# EAGLE design untitled (1) (EAGLE 9.6.2)
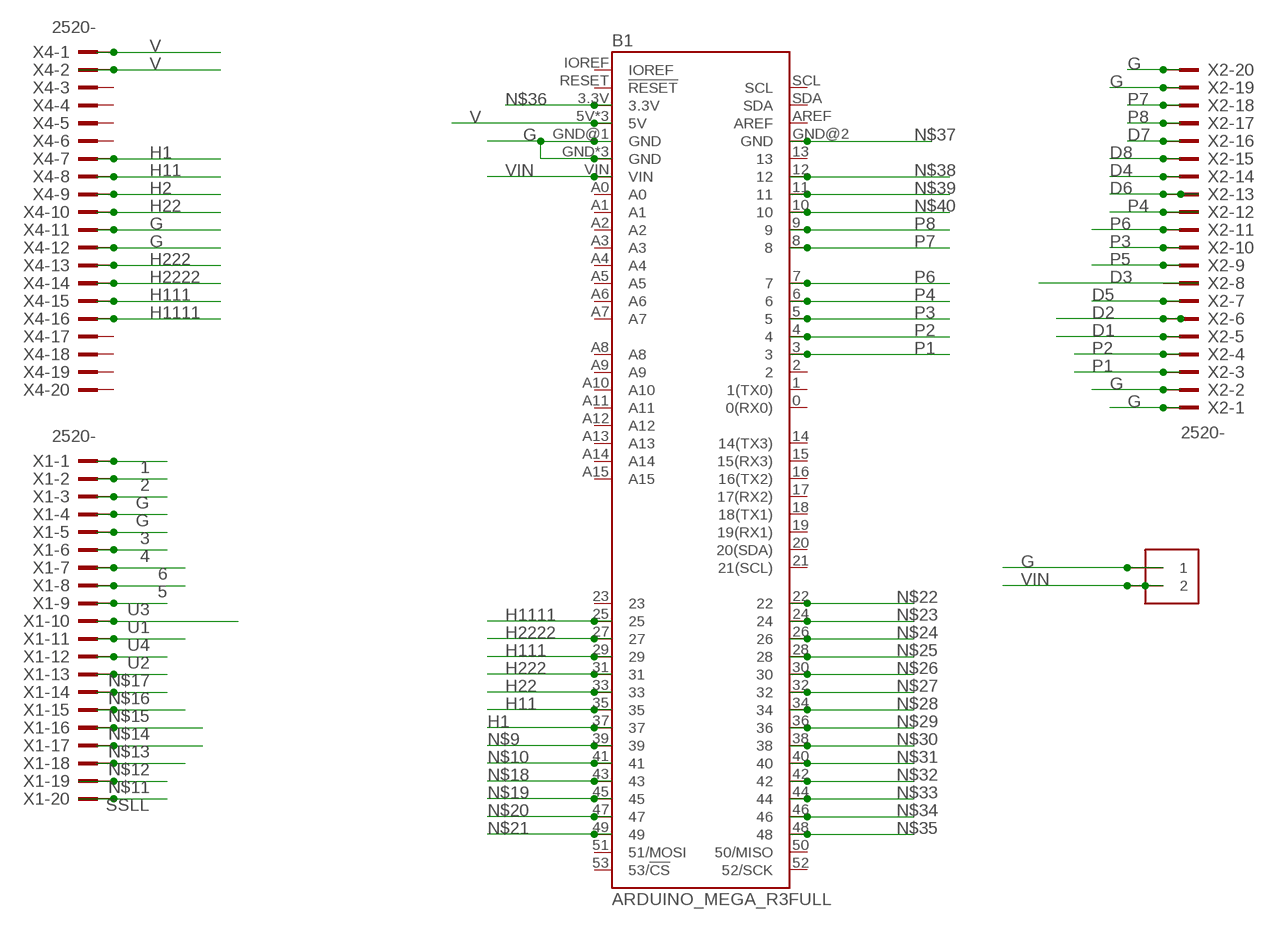
[diagram p0: schematic, sheet 1]

## Parts
B1  ARDUINO_MEGA_R3FULL  [ARDUINO_MEGA_NO_SILK]
J1  1X2-3.5MM  [1X2-3.5MM]
X1  2520-  [PAK100/2500-20]
X2  2520-  [PAK100/2500-20]
X4  2520-  [PAK100/2500-20]

## Nets
1: X1.1
2: X1.2
3: X1.5
4: X1.6
5: X1.8
6: X1.7
D1: X2.5
D2: X2.6
D3: X2.8
D4: X2.14
D5: X2.7
D6: X2.13
D7: X2.16
D8: X2.15
G: B1.GND B1.GND@1(GND) B1.GND@3(GND) B1.GND@4(GND) J1.1 X1.3 X1.4 X2.1 X2.2 X2.19 X2.20 X4.11 X4.12
H1: B1.37 X4.7
H2: X4.9
H11: B1.35 X4.8
H22: B1.33 X4.10
H111: B1.29 X4.15
H222: B1.31 X4.13
H1111: B1.25 X4.16
H2222: B1.27 X4.14
N$9: B1.39
N$10: B1.41
N$11: X1.19
N$12: X1.18
N$13: X1.17
N$14: X1.16
N$15: X1.15
N$16: X1.14
N$17: X1.13
N$18: B1.43
N$19: B1.45
N$20: B1.47
N$21: B1.49
N$22: B1.22
N$23: B1.24
N$24: B1.26
N$25: B1.28
N$26: B1.30
N$27: B1.32
N$28: B1.34
N$29: B1.36
N$30: B1.38
N$31: B1.40
N$32: B1.42
N$33: B1.44
N$34: B1.46
N$35: B1.48
N$36: B1.3.3V
N$37: B1.GND@2(GND)
N$38: B1.12
N$39: B1.11
N$40: B1.10
P1: B1.3 X2.3
P2: B1.4 X2.4
P3: B1.5 X2.10
P4: B1.6 X2.12
P5: X2.9
P6: B1.7 X2.11
P7: B1.8 X2.18
P8: B1.9 X2.17
SSLL: X1.20
U1: X1.10
U2: X1.12
U3: X1.9
U4: X1.11
V: B1.5V B1.5V@1(5V) B1.5V@2(5V) X4.1 X4.2
VIN: B1.VIN J1.2
Unconnected: B1.0(0(RX0)) B1.1(1(TX0)) B1.2 B1.13 B1.14(14(TX3)) B1.15(15(RX3)) B1.16(16(TX2)) B1.17(17(RX2)) B1.18(18(TX1)) B1.19(19(RX1)) B1.20(20(SDA)) B1.21(21(SCL)) B1.23 B1.50(50/MISO) B1.51(51/MOSI) B1.52(52/SCK) B1.53(53/!CS) B1.A0 B1.A1 B1.A2 B1.A3 B1.A4 B1.A5 B1.A6 B1.A7 B1.A8 B1.A9 B1.A10 B1.A11 B1.A12 B1.A13 B1.A14 B1.A15 B1.AREF B1.IOREF B1.RESET(!RESET) B1.SCL B1.SDA X4.3 X4.4 X4.5 X4.6 X4.17 X4.18 X4.19 X4.20

## Library data of the parts
B1 = SparkFun-Boards:ARDUINO_MEGA_R3: Arduino Mega R3 ATmega2560 R3 compatible footprint. SparkFun Products: Arduino Mega 2560 R3 <https://www.sparkfun.com/products/11061>
J1 = adafruit:1X2: 3.5mm Terminal block http://www.ladyada.net/library/pcb/eaglelibrary.html
X1 X2 X4 = con-3m:2520-: 3M (TM) Pak 100 4-Wall Header Source: 3M; OC_FARNELL: unknown; OC_NEWARK: unknown

## Board
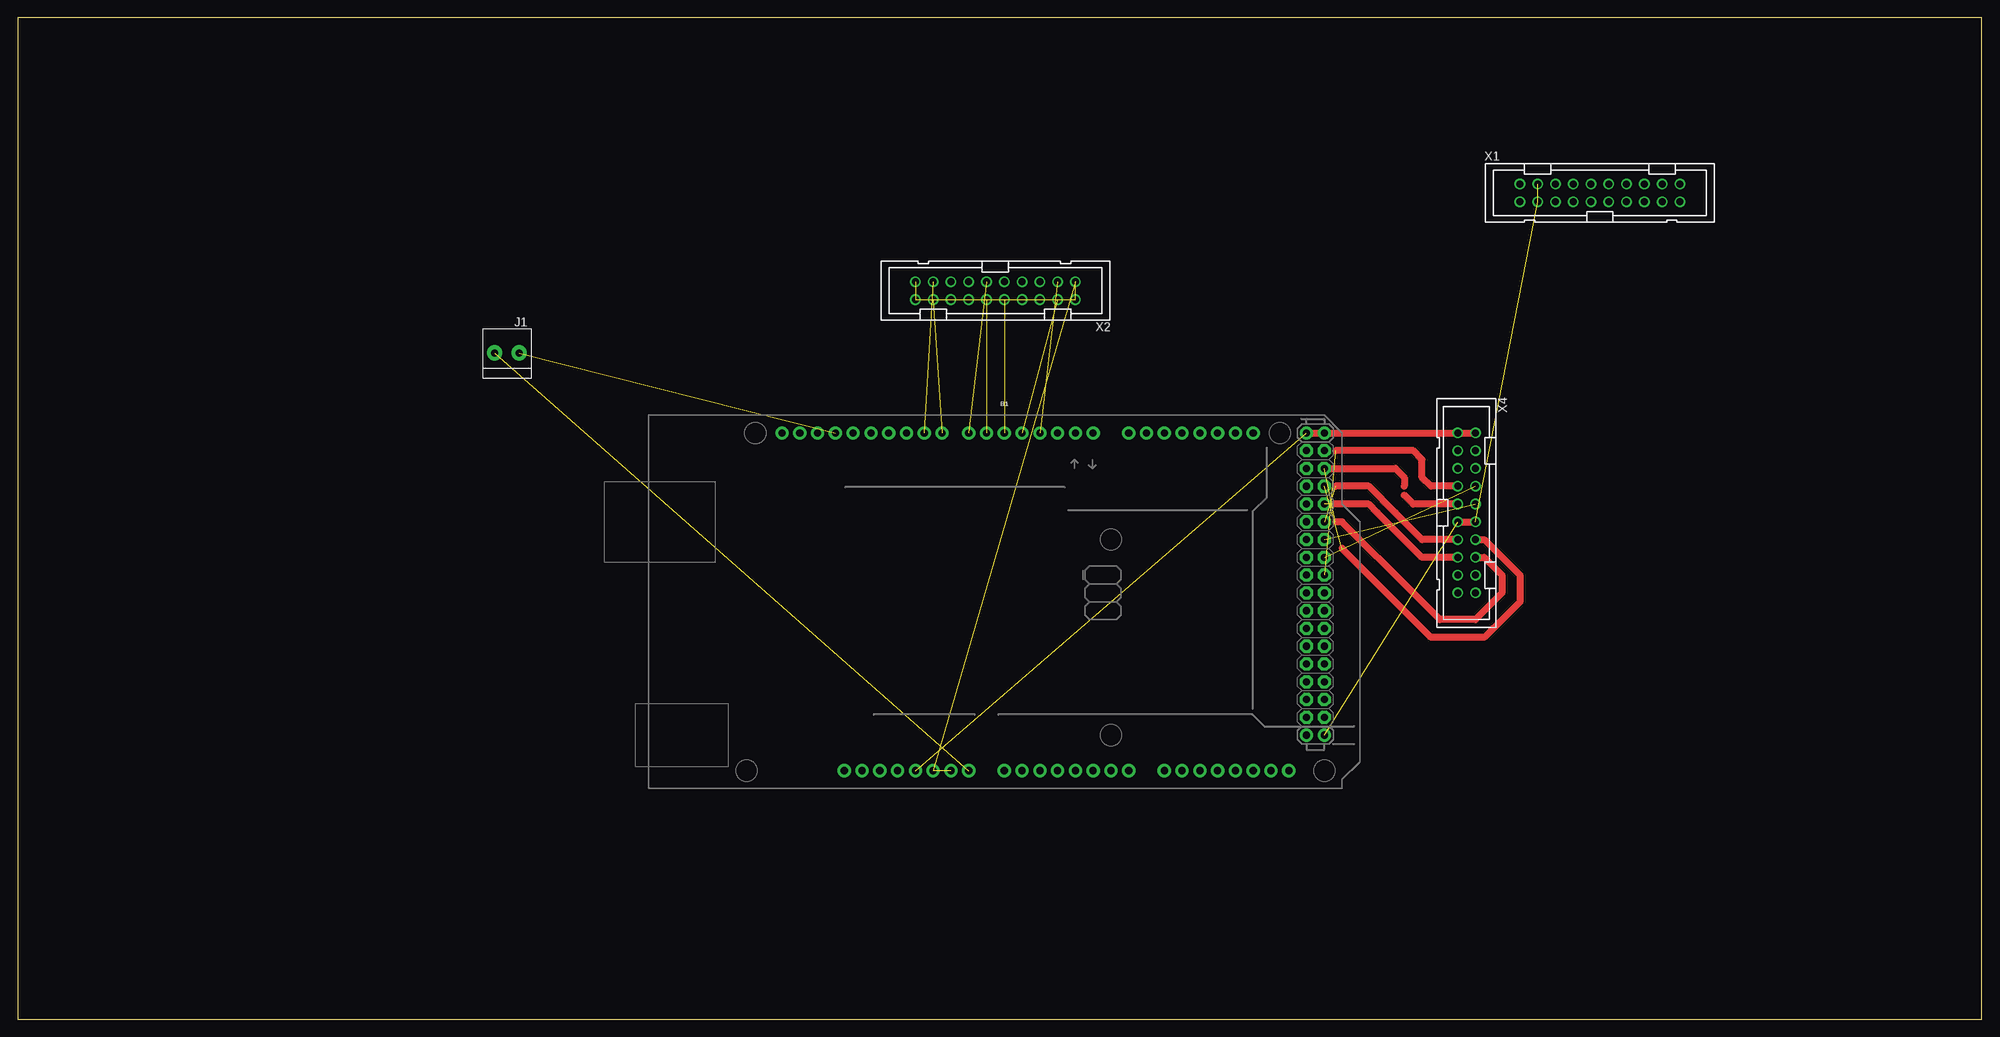
[diagram p1: board, top side]

Size 280.65 x 143.18 mm. Coordinates in mm from the lower left corner, seen from the top.
Outline: 0,0 280.65,0 280.65,143.18 0,143.18 0,0
Copper layers (1*16): Top 0.035mm / dielectric 1.5mm / Bottom 0.035mm
Design rules "default": minimum track width 6mil, minimum drill 0.35mm, track to track 6mil, track to pad 6mil, pad to pad 6mil, via to via 6mil, smd to smd 6mil, copper to edge 40mil, drill to drill 6mil, minimum pad ring 10mil, minimum via ring 8mil, stop-mask expansion 4mil, vias tented up to drill 0mil, thermal gap 10mil

### Footprints (pad centres in the part's own frame; a part is rotated, then mirrored left to right if it is on the bottom)
ARDUINO_MEGA_NO_SILK = drill 1.016 pad 1.88: 0 13.97,24.13; 1 11.43,24.13; 2 8.89,24.13; 3 6.35,24.13; 3.3V -13.97,-24.13; 4 3.81,24.13; 5 1.27,24.13; 5V -11.43,-24.13; 5V@1 44.45,24.13; 5V@2 46.99,24.13; 6 -1.27,24.13; 7 -3.81,24.13; 8 -7.62,24.13; 9 -10.16,24.13; 10 -12.7,24.13; 11 -15.24,24.13; 12 -17.78,24.13; 13 -20.32,24.13; 14 19.05,24.13; 15 21.59,24.13; 16 24.13,24.13; 17 26.67,24.13; 18 29.21,24.13; 19 31.75,24.13; 20 34.29,24.13; 21 36.83,24.13; A0 1.27,-24.13; A1 3.81,-24.13; A2 6.35,-24.13; A3 8.89,-24.13; A4 11.43,-24.13; A5 13.97,-24.13; A6 16.51,-24.13; A7 19.05,-24.13; A8 24.13,-24.13; A9 26.67,-24.13; A10 29.21,-24.13; A11 31.75,-24.13; A12 34.29,-24.13; A13 36.83,-24.13; A14 39.37,-24.13; A15 41.91,-24.13; AREF -25.4,24.13; GND -8.89,-24.13; GND@1 -6.35,-24.13; GND@2 44.45,-19.05; GND@3 46.99,-19.05; GND@4 -22.86,24.13; IOREF -19.05,-24.13; NC -21.59,-24.13; RESET -16.51,-24.13; SCL -30.48,24.13; SDA -27.94,24.13; VIN -3.81,-24.13 | drill 1.016 pad 1.88 octagon: 22 44.45,21.59; 23 46.99,21.59; 24 44.45,19.05; 25 46.99,19.05; 26 44.45,16.51; 27 46.99,16.51; 28 44.45,13.97; 29 46.99,13.97; 30 44.45,11.43; 31 46.99,11.43; 32 44.45,8.89; 33 46.99,8.89; 34 44.45,6.35; 35 46.99,6.35; 36 44.45,3.81; 37 46.99,3.81; 38 44.45,1.27; 39 46.99,1.27; 40 44.45,-1.27; 41 46.99,-1.27; 42 44.45,-3.81; 43 46.99,-3.81; 44 44.45,-6.35; 45 46.99,-6.35; 46 44.45,-8.89; 47 46.99,-8.89; 48 44.45,-11.43; 49 46.99,-11.43; 50 44.45,-13.97; 51 46.99,-13.97; 52 44.45,-16.51; 53 46.99,-16.51
1X2-3.5MM = drill 1 pad 2.184: 1 1.8,0; 2 -1.7,0
PAK100/2500-20 = drill 1 pad 1.422: 1 -11.43,-1.27; 2 -11.43,1.27; 3 -8.89,-1.27; 4 -8.89,1.27; 5 -6.35,-1.27; 6 -6.35,1.27; 7 -3.81,-1.27; 8 -3.81,1.27; 9 -1.27,-1.27; 10 -1.27,1.27; 11 1.27,-1.27; 12 1.27,1.27; 13 3.81,-1.27; 14 3.81,1.27; 15 6.35,-1.27; 16 6.35,1.27; 17 8.89,-1.27; 18 8.89,1.27; 19 11.43,-1.27; 20 11.43,1.27

### Placement (x,y rotation side)
B1  139.7,59.69 0 top
J1  69.85,95.25 0 top
X1  226.06,118.11 0 top
X2  139.7,104.14 180 top
X4  207.01,72.39 270 top

### Tracks (layer width: path | path; a pad name or v marks a point on that pad's centre or on a via)
G  (9 unrouted)
  Top 1.016: X4.11 X4.12
H1  (1 unrouted)
  Top 1.016: X4.7 201.93,76.2 200.66,77.47 200.66,80.01 199.39,81.28 188.29,81.28
H2
  Top 1.016: X4.9 201.93,73.66 199.39,73.66 198.12,74.93
H11  (1 unrouted)
H22  (1 unrouted)
H111  (1 unrouted)
  Top 1.016: X4.15 200.66,66.04 194.31,72.39 193.04,73.66 187.96,73.66
H222  (1 unrouted)
  Top 1.016: X4.13 200.66,68.58 196.85,72.39 193.04,76.2 188.29,76.2
H1111  (1 unrouted)
  Top 1.016: B1.25 196.85,78.74 198.12,77.47 198.12,76.2 | X4.16 209.55,66.04 212.09,63.5 212.09,60.96 208.28,57.15 203.2,57.15 199.39,60.96 189.23,71.12 188.29,71.12
H2222  (1 unrouted)
  Top 1.016: X4.14 209.55,68.58 214.63,63.5 214.63,59.69 210.82,55.88 209.55,54.61 201.93,54.61 189.23,67.31
P1  (1 unrouted)
P2  (1 unrouted)
P3  (1 unrouted)
P4  (1 unrouted)
P6  (1 unrouted)
P7  (1 unrouted)
P8  (1 unrouted)
V  (1 unrouted)
  Top 1.016: B1.5V@1 B1.5V@2 X4.1 X4.2
VIN  (1 unrouted)